# EAGLE schematic untitled (EAGLE 9.6.2)
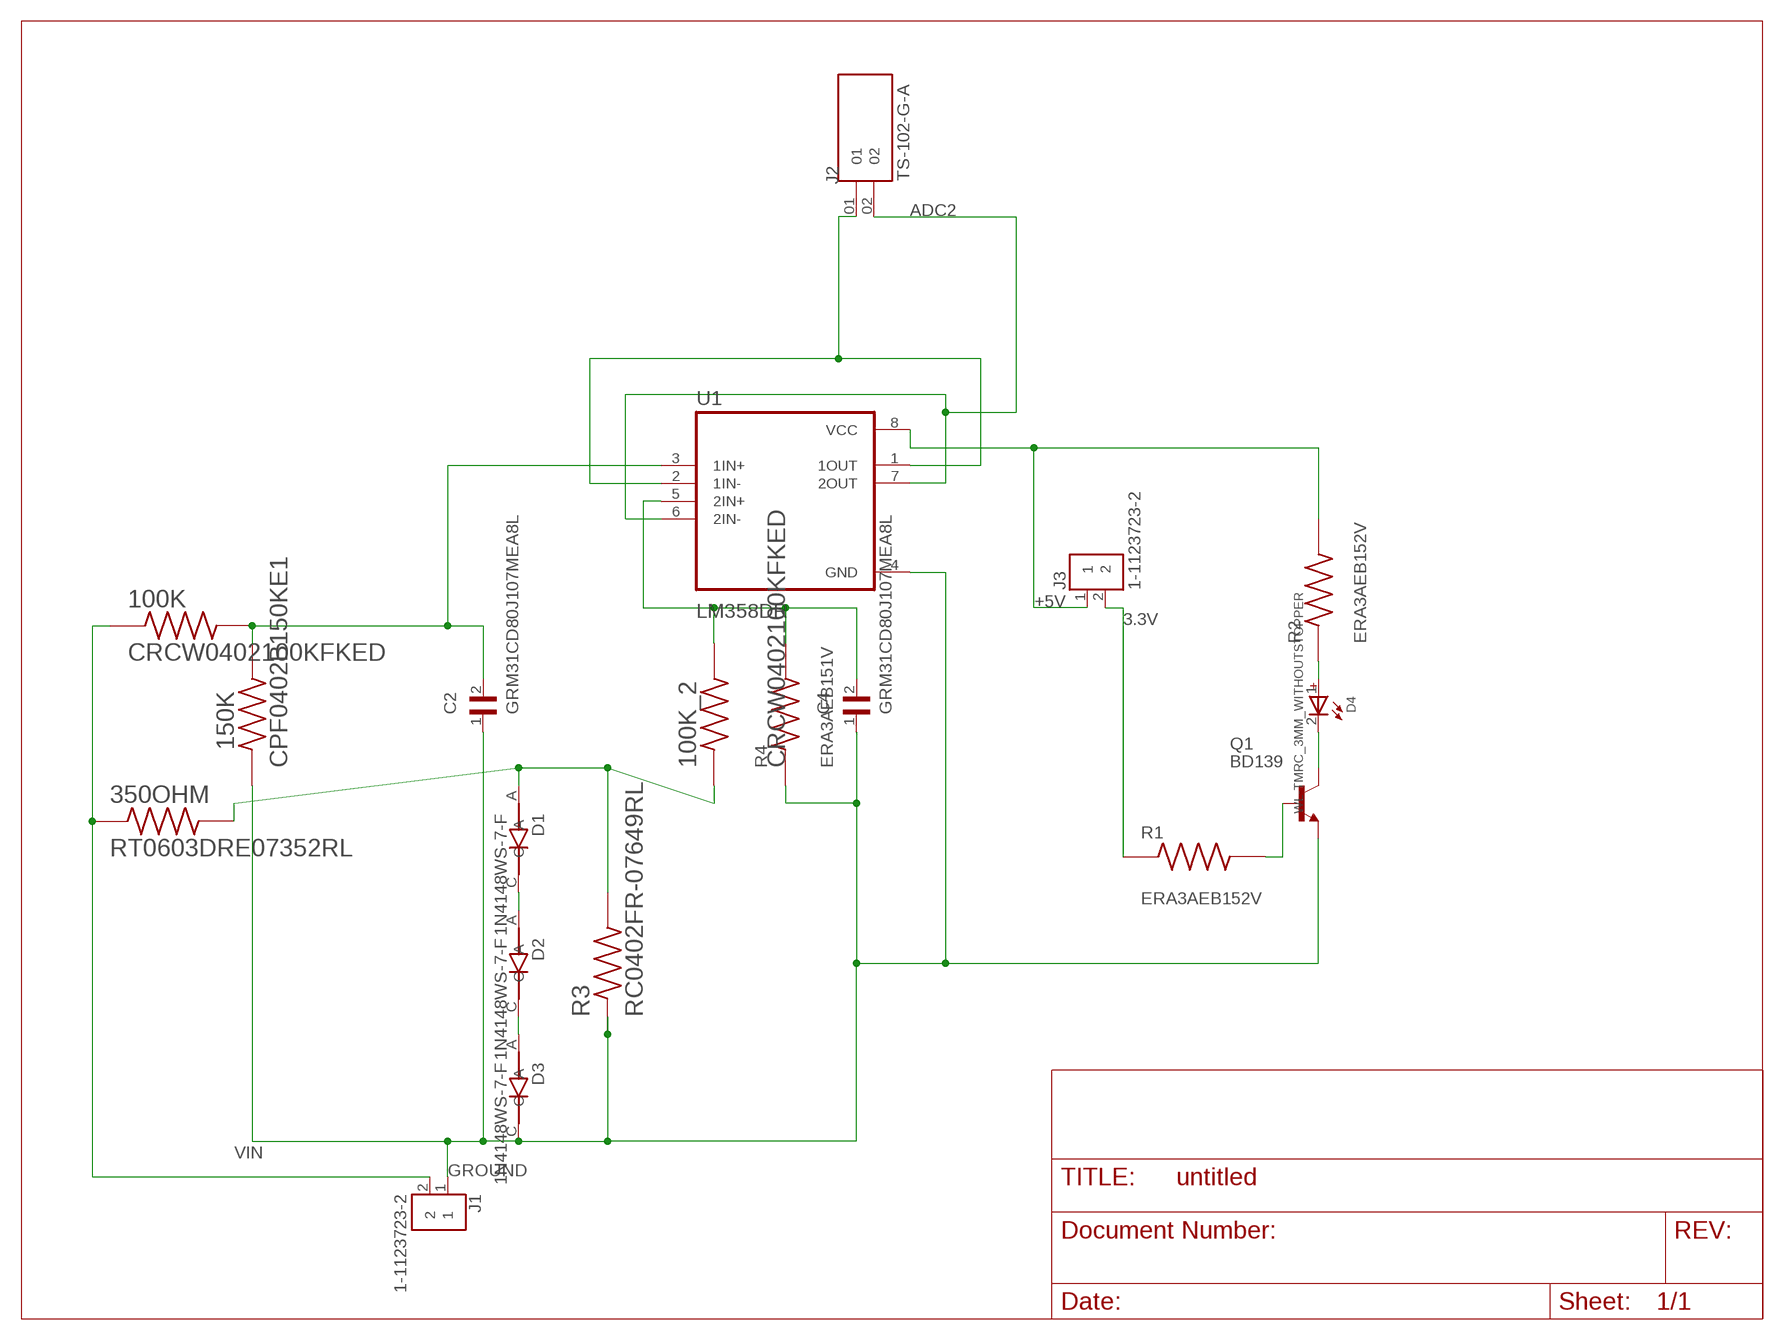
[diagram p0: schematic, sheet 1]

## Parts
100K  CRCW0402100KFKED  [RESC1005X40N]
100K_2  CRCW0402100KFKED  [RESC1005X40N]
150K  CPF0402B150KE1  [RESC1005X35N]
350OHM  RT0603DRE07352RL  [RESC1608X55N]
C2  GRM31CD80J107MEA8L  [CAPC3216X190N]
C4  GRM31CD80J107MEA8L  [CAPC3216X190N]
D1  1N4148WS-7-F  [SOD2513X120N]
D2  1N4148WS-7-F  [SOD2513X120N]
D3  1N4148WS-7-F  [SOD2513X120N]
D4  WL-TMRC_3MM_WITHOUTSTOPPER  [WL-TMRC_3MM]
J1  1-1123723-2  [TE_1-1123723-2]
J2  TS-102-G-A  [SAMTEC_TS-102-G-A]
J3  1-1123723-2  [TE_1-1123723-2]
Q1  BD139  [TO126]
R1  ERA3AEB152V  [RES_ERA3AEB152V]
R2  ERA3AEB152V  [RES_ERA3AEB152V]
R3  RC0402FR-07649RL  [RESC1005X40N]
R4  ERA3AEB151V  [RES_ERA3AEB151V]
U1  LM358DR  [SOIC127P599X175-8N]

## Nets
3.3V: J3.2 R1.1
+5V: J3.1 R2.2 U1.8(VCC)
ADC2: J2.02 U1.6(2IN-) U1.7(2OUT)
GROUND: 150K.1 C2.1 C4.1 D3.C J1.1 Q1.1(E) R3.1 R4.1 U1.4(GND)
N$1: Q1.3(B) R1.2
N$2: D2.C D3.A
N$3: 100K_2.1 350OHM.2 D1.A R3.2
N$4: D1.C D2.A
N$6: 100K.2 150K.2 C2.2 U1.3(1IN+)
N$8: 100K_2.2 C4.2 R4.2 U1.5(2IN+)
N$10: D4.1(+) R2.1
N$11: D4.2(-) Q1.2(C)
N$12: J2.01 U1.1(1OUT) U1.2(1IN-)
VIN: 100K.1 350OHM.1 J1.2

## Library data of the parts
100K 100K_2 = CRCW0402100KFKED:CRCW0402100KFKED
150K = CPF0402B150KE1:CPF0402B150KE1: Check availability <https://pricing.snapeda.com/parts/CPF0402B150KE1/TE%20Connectivity/view-part?ref=eda>; AVAILABILITY: In Stock; CHECK_PRICES: https://www.snapeda.com/parts/CPF0402B150KE1/TE+Connectivity/view-part/?ref=eda; COMMENT: 3-1879216-2; DESCRIPTION: CPF0402 150K 0.1% 25PPM 1K RL; EU_ROHS_COMPLIANCE: Compliant; MF: TE Connectivity; MP: CPF0402B150KE1; PACKAGE: 0402; POWER_RATING: .063 W; PRICE: None; RESISTANCE: 150K; SNAPEDA_LINK: https://www.snapeda.com/parts/CPF0402B150KE1/TE+Connectivity/view-part/?ref=snap; TOLERANCE: .1%; VOLTAGE_RATING: 25 V
350OHM = RT0603DRE07352RL:RT0603DRE07352RL
C2 C4 = GRM31CD80J107MEA8L:GRM31CD80J107MEA8L; CHECK_PRICES: https://www.snapeda.com/parts/GRM31CD80J107MEA8L/Murata/view-part/?ref=eda; DESCRIPTION: SMD capacitor X6T(EIA) with capacitance 100uF Tol.20%. Rated voltage 6.3Vdc 105C; DIGIKEY_PART_NUMBER: 490-GRM31CD80J107MEA8LTR-ND; MF: Murata; MP: GRM31CD80J107MEA8L; PACKAGE: 3216-2 Murata; SNAPEDA_LINK: https://www.snapeda.com/parts/GRM31CD80J107MEA8L/Murata/view-part/?ref=snap
D1-D3 = 1N4148WS-7-F:1N4148WS-7-F: Check availability <https://pricing.snapeda.com/parts/1N4148WS-7-F/Diodes%20Inc./view-part?ref=eda>; AVAILABILITY: In Stock; CHECK_PRICES: https://www.snapeda.com/parts/1N4148WS-7-F/Diodes+Inc./view-part/?ref=eda; DESCRIPTION: Diode Switching 75V 0.3A 2-Pin SOD-323 | Diodes Inc 1N4148WS-7-F; MF: Diodes Inc.; MP: 1N4148WS-7-F; PACKAGE: SOD-323 Diodes Inc.; PRICE: None; SNAPEDA_LINK: https://www.snapeda.com/parts/1N4148WS-7-F/Diodes+Inc./view-part/?ref=snap
D4 = WL-TMRC_3MM:WL-TMRC_3MM
J1 J3 = 1-1123723-2:1-1123723-2: Check availability <https://pricing.snapeda.com/parts/1-1123723-2/TE%20Connectivity/view-part?ref=eda>; AVAILABILITY: In Stock; CENTERLINE_PITCH: 3.96 mm[.156 in]; CHECK_PRICES: https://www.snapeda.com/parts/1-1123723-2/TE+Connectivity+AMP+Connectors/view-part/?ref=eda; COMMENT: 1-1123723-2; DESCRIPTION: Header, Conn,High Current,PCB Plug,2 Cont,Solder,Breakaway,0.156 Pin-Spng,7.5A | TE Connectivity 1-1123723-2; EU_ROHS_COMPLIANCE: Compliant; MF: TE Connectivity; MP: 1-1123723-2; NUMBER_OF_POSITIONS: 2; PACKAGE: None; PRICE: None; PRODUCT_TYPE: Header; SNAPEDA_LINK: https://www.snapeda.com/parts/1-1123723-2/TE+Connectivity+AMP+Connectors/view-part/?ref=snap
J2 = TS-102-G-A:TS-102-G-A; MANUFACTURER: Samtec Inc.; PARTREV: R; STANDARD: Manufacturer Recommendations
Q1 = BD139_:BD139*: Check availability <https://pricing.snapeda.com/parts/BD139/STMicroelectronics/view-part?ref=eda>; AVAILABILITY: In Stock; CHECK_PRICES: https://www.snapeda.com/parts/BD139/STMicroelectronics/view-part/?ref=eda; DESCRIPTION: Bipolar (BJT) Transistor NPN 80 V 1.5 A - 1.25 W Through Hole SOT-32-3; MF: STMicroelectronics; MP: BD139; PACKAGE: TO-126 STMicroelectronics; PRICE: None; SNAPEDA_LINK: https://www.snapeda.com/parts/BD139/STMicroelectronics/view-part/?ref=snap
R1 R2 = ERA3AEB152V:ERA3AEB152V; MANUFACTURER: Panasonic; MAXIMUM_PACKAGE_HEIGHT: 0.45 mm; PARTREV: 3/1/2020; STANDARD: Manufacturer Recommendations
R3 = RC0402FR-07649RL:RC0402FR-07649RL
R4 = ERA3AEB151V:ERA3AEB151V; MANUFACTURER: Panasonic; MAXIMUM_PACKAGE_HEIGHT: 0.45 mm; PARTREV: 3/1/2020; STANDARD: Manufacturer Recommendations
U1 = LM358DR:LM358DR